# EAGLE design irisc (EAGLE 9.2.2)
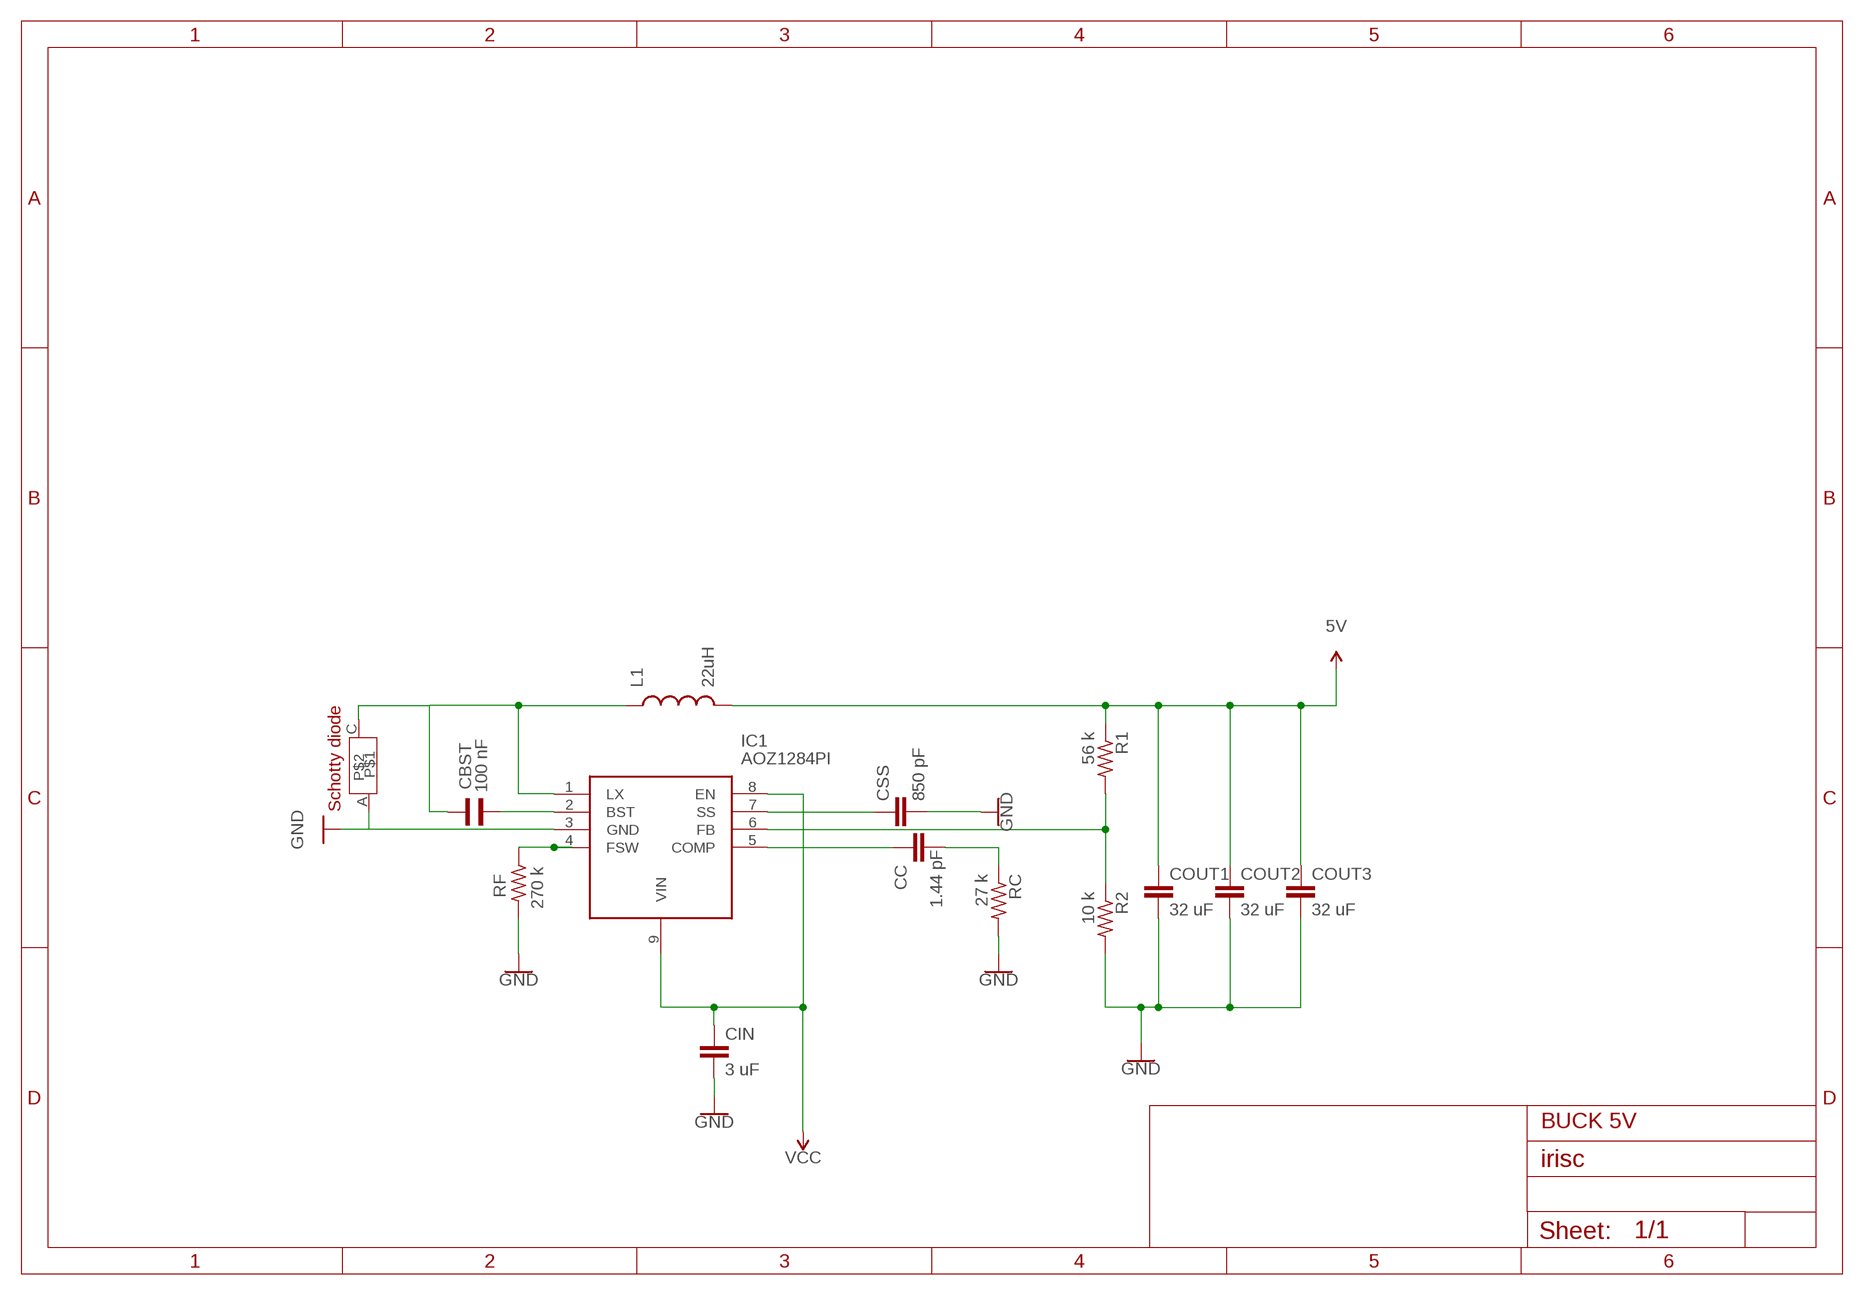
[diagram p0: schematic, sheet 1]

## Parts
CBST  100 nF  WCAP-CSGP_0805_885012006018_WAVE  [WCAP-CSGP_0805_WAVE]
CC  1.44 pF  CC1206  [C1206]
CIN  3 uF  CC1210  [C1210]
COUT1  32 uF  CC1812  [C1812]
COUT2  32 uF  CC1812  [C1812]
COUT3  32 uF  CC1812  [C1812]
CSS  850 pF  C  [C0805]
IC1  AOZ1284PI  [SOIC127P600X170-9N]
L1  22uH  INDUCTOR  [L0603]
R1  56 k  FLIPFLOP-RES  [0805-THM]
R2  10 k  FLIPFLOP-RES  [0805-THM]
RC  27 k  FLIPFLOP-RES  [0805-THM]
RF  270 k  FLIPFLOP-RES  [0805-THM]
U$1  SCHOTTY-DIODE-IRISC  [DO-214AC]

## Nets
5V: COUT1.1 COUT2.1 COUT3.1 L1.2 R1.1
GND: CIN.2 COUT1.2 COUT2.2 COUT3.2 CSS.2 IC1.3(GND) R2.2 RC.2 RF.2 U$1.A
N$2: IC1.4(FSW) RF.1
N$3: CBST.2 IC1.2(BST)
N$4: CBST.1 IC1.1(LX) L1.1 U$1.C
N$6: CC.1 IC1.5(COMP)
N$7: CSS.1 IC1.7(SS)
N$140: IC1.6(FB) R1.2 R2.1
N$141: CC.2 RC.1
VCC: CIN.1 IC1.8(EN) IC1.9(VIN)

## Notes on the sheet
- BUCK 5V

## Library data of the parts
CBST = Wurth_Elektronik_Passive_Capacitors_rev18b:WCAP-CSGP_0805: WCAP-CSGP Ceramic Capacitors Characteristics Multilayer Ceramic Chip Capacitor Recommended soldering:Reflow, for 0603 and 0805 wave soldering is also allowed Operating temperature:-55 °C to +125 °C; Ceramic characteristics: Class I - NPO ; Class II -X7R, X5R High performance ceramic High capacitance stability Minimal aging Termination:Cu/Ni/Sn <http://katalog.we-online.de/media/images/eisos/WCAP-CSGP_pf2.jpg> Details see: http://katalog.we-online.de/en/pbs/WCAP-CSGP-0805? Created: 2015-01-28 2015 (C) Wurth Elektronik; SPICEPREFIX: C
CC CIN COUT1-COUT3 CSS = eagle-ltspice:C: CAPACITOR, European symbol; SPICEMODEL: NONE; SPICEPREFIX: C
IC1 = AOZ1284PI:AOZ1284PI: IC REG BUCK ADJ 4A 8SO Source: Datasheet <http://datasheet.octopart.com/AOZ1284PI-Alpha-&-Omega-Semiconductor-datasheet-68364838.pdf>; DESCRIPTION: IC REG BUCK ADJ 4A 8SO; HEIGHT: 1.7mm; MANUFACTURER_NAME: Alpha & Omega Semiconductors; MANUFACTURER_PART_NUMBER: AOZ1284PI
L1 = BeagleBone_Blue_R3:INDUCTOR: Inductors Basic Inductor/Choke - 0603 and 1206. Footprints are not proven and vary greatly between part numbers. SRN6045- 33uH, 20% 1.4A
R1 R2 RC RF = adafruit:FLIPFLOP-RES: Flip Flop resistor An 0805 resistor inside a standard 1/4W 5% resistor. Makes for easy mods; SPICEPREFIX: R
U$1 = DO-214AC:SCHOTTY-DIODE-IRISC: Footprint : DO-214AB ,8 A, 60 V

## Board
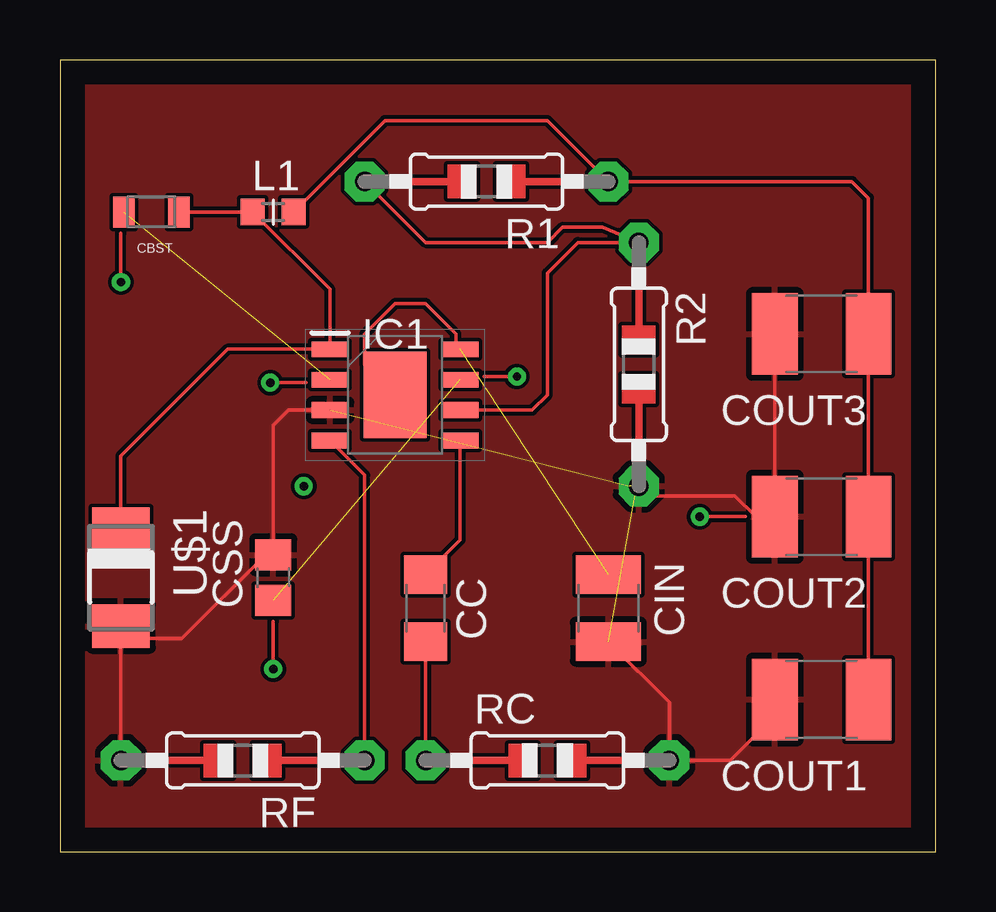
[diagram p1: board, top side]
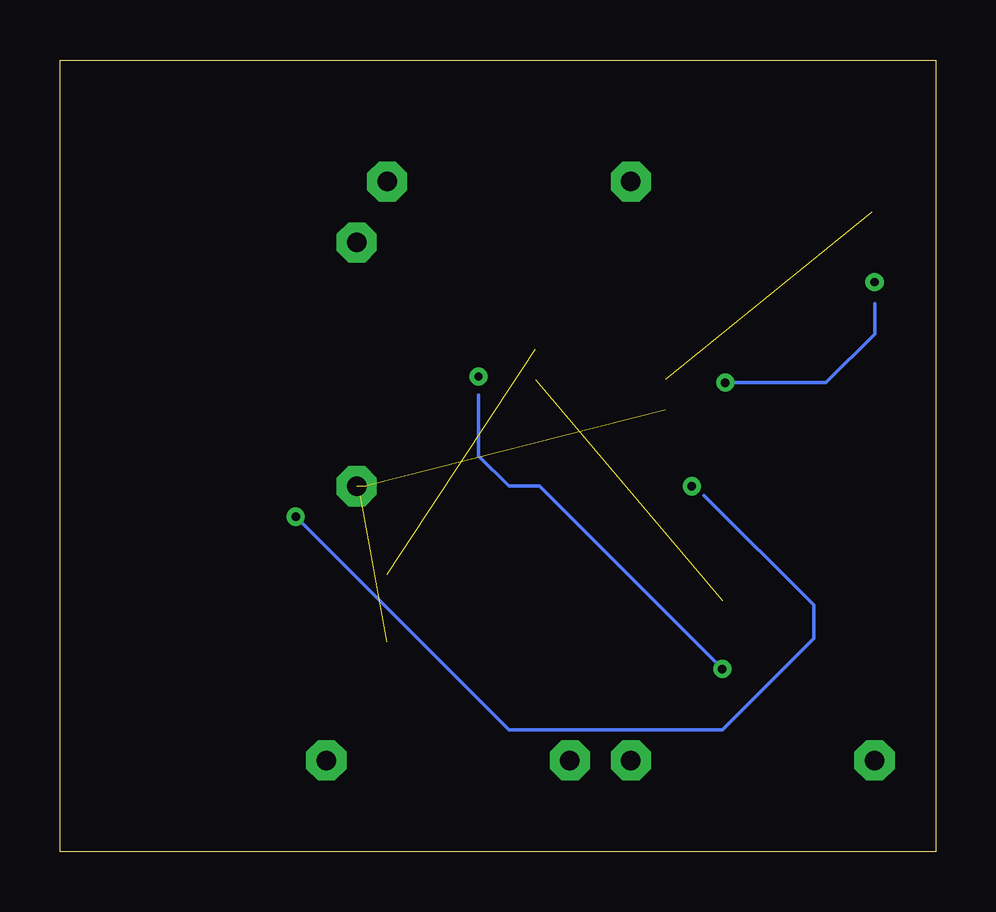
[diagram p2: board, bottom side, seen from below]

Size 36.5 x 33.01 mm. Coordinates in mm from the lower left corner, seen from the top.
Outline: 0,0 36.5,0 36.5,33.01 0,33.01 0,0
Copper layers (1*16): Top 0.035mm / dielectric 1.5mm / Bottom 0.035mm
Design rules "default": minimum track width 6mil, minimum drill 0.35mm, track to track 6mil, track to pad 6mil, pad to pad 6mil, via to via 6mil, smd to smd 6mil, copper to edge 40mil, drill to drill 6mil, minimum pad ring 10mil, minimum via ring 8mil, stop-mask expansion 4mil, vias tented up to drill 0mil, thermal gap 10mil

### Footprints (pad centres in the part's own frame; a part is rotated, then mirrored left to right if it is on the bottom)
WCAP-CSGP_0805_WAVE = smd 0.9 x 1.3: 1 -1.15,0; 2 1.15,0
C1206 = smd 1.6 x 1.8: 1 -1.4,0; 2 1.4,0
C1210 = smd 1.6 x 2.7: 1 -1.4,0; 2 1.4,0
C1812 = smd 1.9 x 3.4: 1 -1.95,0; 2 1.95,0
C0805 = smd 1.3 x 1.5: 1 -0.95,0; 2 0.95,0
SOIC127P600X170-9N = smd 1.525 x 0.65: 1 -2.712,1.905; 2 -2.712,0.635; 3 -2.712,-0.635; 4 -2.712,-1.905; 5 2.712,-1.905; 6 2.712,-0.635; 7 2.712,0.635; 8 2.712,1.905 | smd 2.61 x 3.6: 9 0,0
L0603 = smd 1 x 1.1: 1 -0.85,0; 2 0.85,0
0805-THM = drill 0.813 pad 1.676 octagon: 1 -5.08,0; 2 5.08,0
DO-214AC = smd 1.8 x 2.4: A 2.025,0; C -2.025,0

### Placement (x,y rotation side)
CBST  3.81,26.67 180 top
CC  15.24,10.16 270 top
CIN  22.86,10.16 270 top
COUT1  31.75,6.35 180 top
COUT2  31.75,13.97 180 top
COUT3  31.75,21.59 180 top
CSS  8.89,11.43 90 top
IC1  13.97,19.05 0 top
L1  8.89,26.67 0 top
R1  17.78,27.94 180 top
R2  24.13,20.32 270 top
RC  20.32,3.81 0 top
RF  7.62,3.81 180 top
U$1  2.54,11.43 270 top

### Tracks (layer width: path | path; a pad name or v marks a point on that pad's centre or on a via)
5V
  Top 0.152: COUT1.1 COUT2.1 COUT3.1 33.7,27.26 33.02,27.94 R1.1 20.32,30.48 13.55,30.48 L1.2
GND  (3 unrouted)
  Top 0.152: IC1.3 9.53,18.41 8.89,17.78 CSS.2 8.57,12.38 5.08,8.89 3.06,8.89 2.8,9.15 | 2.8,9.15 U$1.A | RF.2 2.54,8.89 2.8,9.15 | CIN.2 25.4,6.22 RC.2 27.94,3.81 30.48,6.35 COUT1.2 | COUT3.2 29.8,14.65 30.48,13.97 COUT2.2 29.01,13.97 28.14,14.84 23.97,14.84 23.75,15.06 23.75,15.24
  pour Top: 0,0 36.83,0 36.83,33.02 0,33.02
N$1  (via drill 0.35)
  Top 0.152: v8.89,7.62 8.89,9.6
  Bottom 0.152: v8.89,7.62 16.51,15.24 17.78,15.24 19.05,16.51 19.05,19.05
N$2
  Top 0.152: RF.1 12.7,15.7 IC1.4
N$3  (1 unrouted)
N$4
  Top 0.152: CBST.1 L1.1 11.26,23.45 IC1.1 6.99,20.96 2.54,16.51 U$1.C
N$5  (via drill 0.35)
  Top 0.152: v19.05,19.81 17.67,19.81
N$6
  Top 0.152: IC1.5 16.68,13 CC.1
N$7  (1 unrouted)
N$8  (via drill 0.35)
  Top 0.152: v8.76,19.56 10.27,19.56
  Bottom 0.152: v8.76,19.56 4.57,19.56 2.54,21.59 2.54,22.86
N$9  (via drill 0.35)
  Top 0.152: v2.54,23.75 2.54,25.78
N$10  (via drill 0.35)
  Top 0.152: v26.67,13.97 28.57,13.97
  Bottom 0.152: v26.67,13.97 17.78,5.08 8.89,5.08 5.08,8.89 5.08,10.29 9.65,14.86
N$11  (via drill 0.35)
  other vias: 10.16,15.24
N$140
  Top 0.152: IC1.6 19.68,18.41 20.32,19.05 20.32,24.13 21.59,25.4 R2.1 22.61,26.04 20.95,26.04 20.32,25.4 15.24,25.4 R1.2
N$141
  Top 0.152: CC.2 RC.1
VCC  (1 unrouted)
  Top 0.152: IC1.8 16.51,21.13 16.51,21.59 15.24,22.86 13.97,22.86 12.7,21.59 12.7,20.32 IC1.9